# EAGLE design geiger (EAGLE 8.3.2)
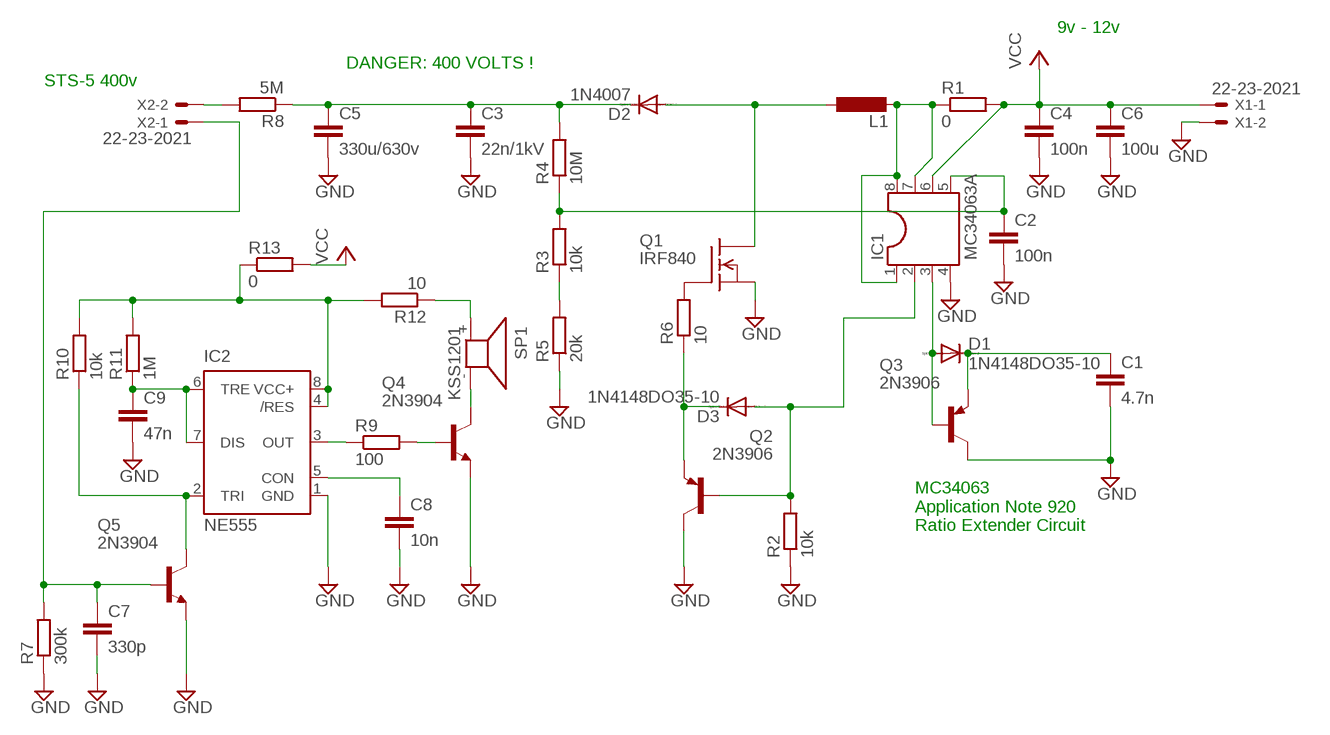
[diagram p0: schematic, sheet 1]

## Parts
C1  4.7n  C-EU025-025X050  [C025-025X050]
C2  100n  C-EU025-025X050  [C025-025X050]
C3  22n/1kV  C-EU050-050X075  [C050-050X075]
C4  100n  C-EU025-025X050  [C025-025X050]
C5  330u/630v  C-EU050-050X075  [C050-050X075]
C6  100u  C-EU025-025X050  [C025-025X050]
C7  330p  C-EU025-025X050  [C025-025X050]
C8  10n  C-EU025-025X050  [C025-025X050]
C9  47n  C-EU025-025X050  [C025-025X050]
D1  1N4148DO35-10  [DO35-10]
D2  1N4007  DIODE-D-7.5  [D-7.5]
D3  1N4148DO35-10  [DO35-10]
IC1  MC34063A  DIL8  [DIL08]
IC2  NE555  [DIL-08]
L1  L-EU0207/12  [0207/12]
Q1  IRF840  [TO220]
Q2  2N3906  [TO92]
Q3  2N3906  [TO92]
Q4  2N3904  [TO92]
Q5  2N3904  [TO92]
R1  0  R-EU_0204/7  [0204/7]
R2  10k  R-EU_0204/7  [0204/7]
R3  10k  R-EU_0204/7  [0204/7]
R4  10M  R-EU_0204/7  [0204/7]
R5  20k  R-EU_0204/7  [0204/7]
R6  10  R-EU_0204/7  [0204/7]
R7  300k  R-EU_0204/7  [0204/7]
R8  5M  R-EU_0204/7  [0204/7]
R9  100  R-EU_0204/7  [0204/7]
R10  10k  R-EU_0204/7  [0204/7]
R11  1M  R-EU_0204/7  [0204/7]
R12  10  R-EU_0204/7  [0204/7]
R13  0  R-EU_0204/7  [0204/7]
SP1  KSS1201  [KSS1201]
X1  22-23-2021  [22-23-2021]
X2  22-23-2021  [22-23-2021]

## Nets
GND: C1.2 C2.2 C3.2 C4.2 C5.2 C6.2 C7.2 C8.2 C9.2 IC1.4 IC2.1(GND) Q1.3(S) Q2.1(C) Q3.1(C) Q4.3(E) Q5.3(E) R2.1 R5.1 R7.1 X1.2
N$1: D1.A IC1.3 Q3.2(B)
N$2: C1.1 D1.C Q3.3(E)
N$3: D2.A L1.1 Q1.2(D)
N$4: R3.1 R5.2
N$5: IC1.1 IC1.7 IC1.8 L1.2 R1.1
N$6: D3.C Q2.3(E) R6.1
N$7: IC2.4(/RES) IC2.8(VCC+) R10.2 R11.2 R12.2 R13.1
N$8: C3.1 C5.1 D2.C R4.2 R8.1
N$9: Q1.1(G) R6.2
N$10: C7.1 Q5.2(B) R7.2 X2.1
N$11: D3.A IC1.2 Q2.2(B) R2.2
N$12: R8.2 X2.2
N$13: IC2.2(TRI) Q5.1(C) R10.1
N$14: C8.1 IC2.5(CON)
N$15: IC2.3(OUT) R9.1
N$16: Q4.2(B) R9.2
N$17: Q4.1(C) SP1.-
N$18: C9.1 IC2.6(TRE) IC2.7(DIS) R11.1
N$19: R12.1 SP1.+
N$20: C2.1 IC1.5 R3.2 R4.1
VCC: C4.1 C6.1 IC1.6 R1.2 R13.2 X1.1

## Notes on the sheet
- 9v - 12v
- DANGER: 400 VOLTS !
- STS-5 400v
- MC34063
  Application Note 920
  Ratio Extender Circuit

## Library data of the parts
C1-C9 = rcl:C-EU: CAPACITOR, European symbol
D1 D3 = diode:1N4148: DIODE high speed (Philips)
D2 = diode:DIODE-: DIODE
IC1 = ic-package:DIL8: Dual In Line / Socket
IC2 = st-microelectronics:NE555: General purpose bipolar Timer; MF: Arrow Electronics; MPN: NE555N; OC_FARNELL: 1467742; OC_NEWARK: 89K1486
L1 = rcl:L-EU: INDUCTOR, European symbol
Q1 = transistor-fet:IRF840: N-Channel Enhancement MOSFET (HEXFET); 500V; 8A; 0,85Ohm
Q2 Q3 = transistor-pnp:2N3906: PNP Transistor
Q4 Q5 = transistor-npn:2N3904: NPN Transistor
R1-R13 = rcl:R-EU_: RESISTOR, European symbol
SP1 = buzzer:KSS1201: SPEAKER Source: Schukat; OC_FARNELL: unknown; OC_NEWARK: unknown
X1 X2 = con-molex:22-23-2021: .100" (2.54mm) Center Header - 2 Pin; MF: MOLEX; MPN: 22-23-2021; OC_FARNELL: 1462926; OC_NEWARK: 25C3832

## Board
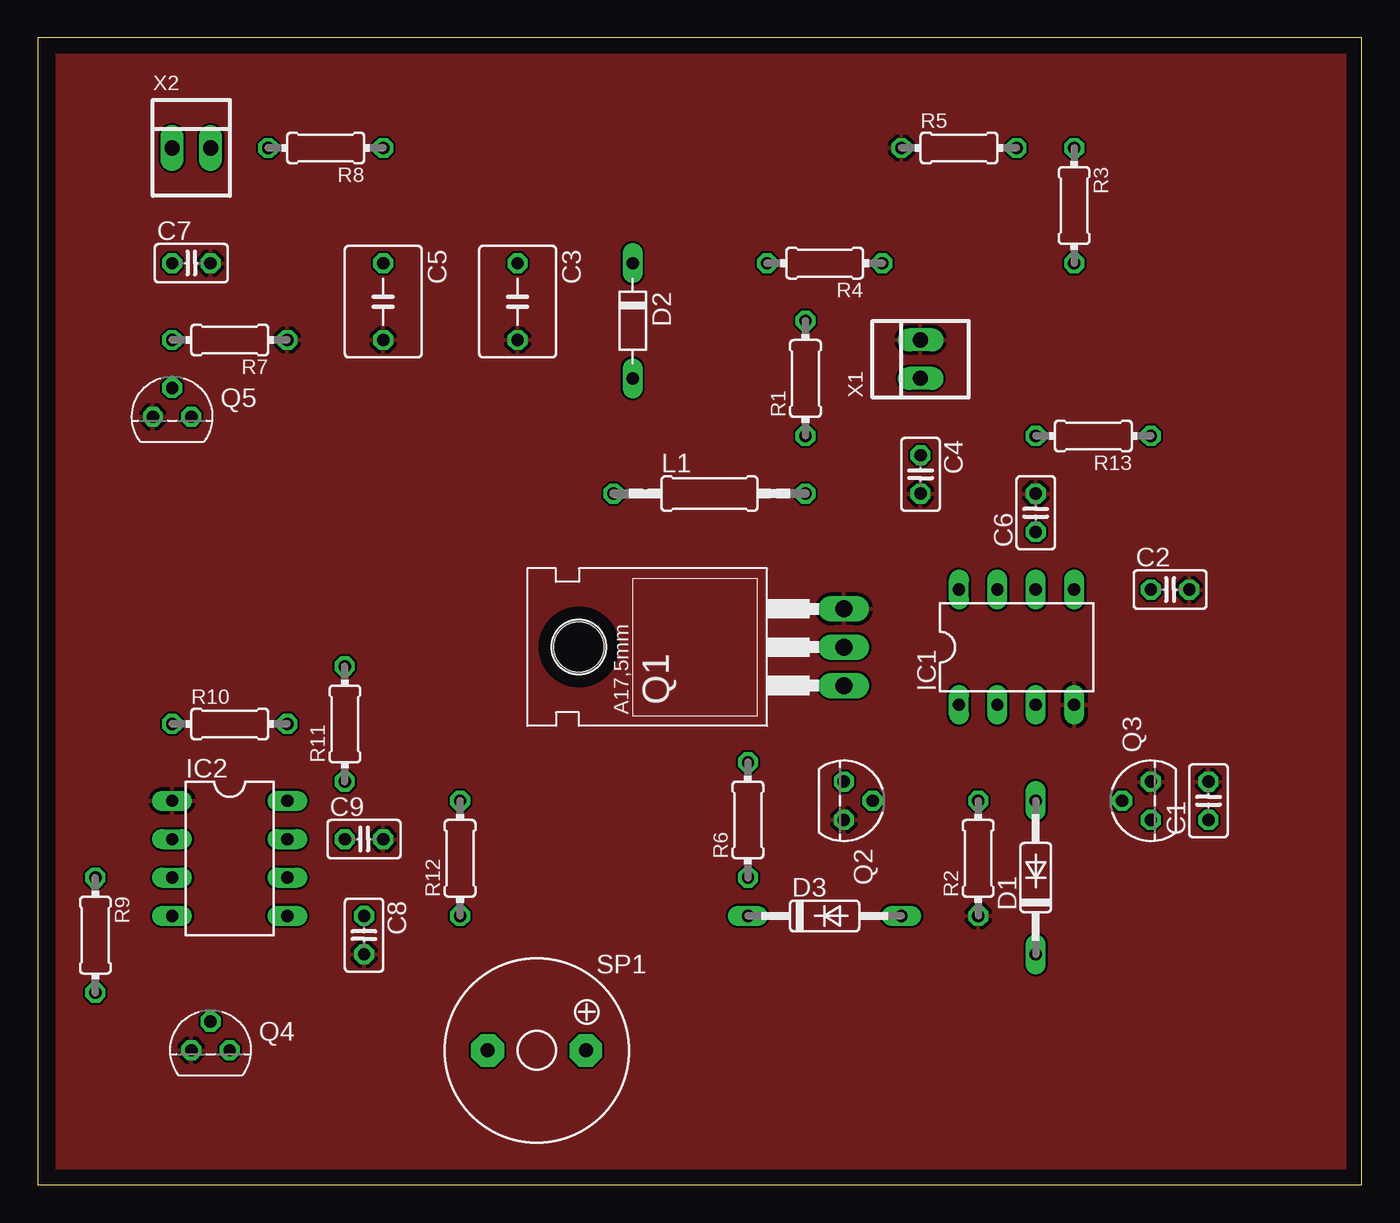
[diagram p1: board, top side]
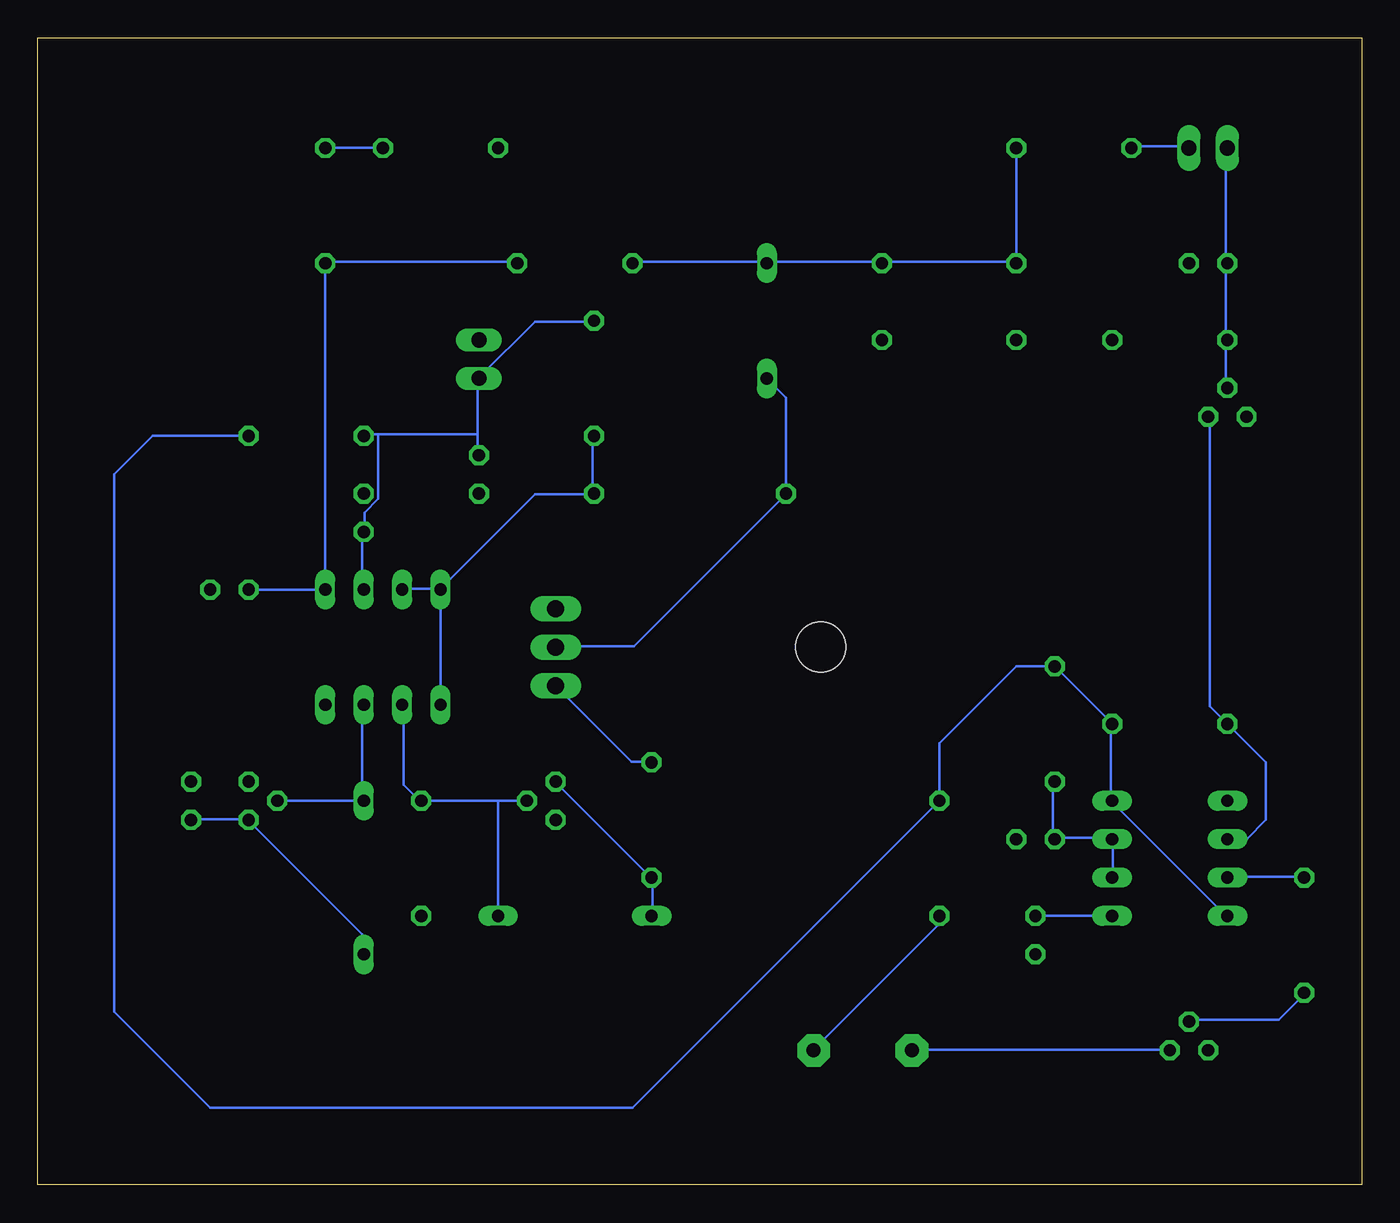
[diagram p2: board, bottom side, seen from below]

Size 87.61 x 75.87 mm. Coordinates in mm from the lower left corner, seen from the top.
Outline: 0,0 87.61,0 87.61,75.87 0,75.87 0,0
Copper layers (1*16): Top 0.035mm / dielectric 1.5mm / Bottom 0.035mm
Design rules "default": minimum track width 6mil, minimum drill 0.35mm, track to track 6mil, track to pad 6mil, pad to pad 6mil, via to via 6mil, smd to smd 6mil, copper to edge 40mil, drill to drill 6mil, minimum pad ring 10mil, minimum via ring 8mil, stop-mask expansion 4mil, vias tented up to drill 0mil, thermal gap 10mil

### Footprints (pad centres in the part's own frame; a part is rotated, then mirrored left to right if it is on the bottom)
C025-025X050 = drill 0.813 octagon: 1 -1.27,0; 2 1.27,0
C050-050X075 = drill 0.813 octagon: 1 -2.54,0; 2 2.54,0
DO35-10 = drill 0.813 long: A 5.08,0; C -5.08,0
D-7.5 = drill 0.813 long: A 3.81,0; C -3.81,0
DIL08 = drill 0.813 long: 1 -3.81,-3.81; 2 -1.27,-3.81; 3 1.27,-3.81; 4 3.81,-3.81; 5 3.81,3.81; 6 1.27,3.81; 7 -1.27,3.81; 8 -3.81,3.81
DIL-08 = drill 0.813 long: 1 -3.81,-3.81; 2 -1.27,-3.81; 3 1.27,-3.81; 4 3.81,-3.81; 5 3.81,3.81; 6 1.27,3.81; 7 -1.27,3.81; 8 -3.81,3.81
0207/12 = drill 0.813 octagon: 1 -6.35,0; 2 6.35,0
TO220 = drill 1.118 long: 1 -2.54,-6.35; 2 0,-6.35; 3 2.54,-6.35 | hole 3.302: 0,11.176
TO92 = drill 0.813 octagon: 1 1.27,0; 2 0,1.905; 3 -1.27,0
0204/7 = drill 0.813 octagon: 1 -3.81,0; 2 3.81,0
KSS1201 = drill 0.914 pad 2.159 octagon: + 3.251,0; - -3.251,0
22-23-2021 = drill 1 long: 1 -1.27,0; 2 1.27,0

### Placement (x,y rotation side)
C1  77.47,25.4 90 top
C2  74.93,39.37 0 top
C3  31.75,58.42 270 top
C4  58.42,46.99 270 top
C5  22.86,58.42 270 top
C6  66.04,44.45 90 top
C7  10.16,60.96 0 top
C8  21.59,16.51 270 top
C9  21.59,22.86 0 top
D1  66.04,20.32 90 top
D2  39.37,57.15 270 top
D3  52.07,17.78 0 top
IC1  64.77,35.56 0 top
IC2  12.7,21.59 270 top
L1  44.45,45.72 0 top
Q1  46.99,35.56 90 top
Q2  53.34,25.4 270 top
Q3  73.66,25.4 90 top
Q4  11.43,8.89 0 top
Q5  8.89,50.8 0 top
R1  50.8,53.34 90 top
R2  62.23,21.59 90 top
R3  68.58,64.77 270 top
R4  52.07,60.96 180 top
R5  60.96,68.58 0 top
R6  46.99,24.13 90 top
R7  12.7,55.88 180 top
R8  19.05,68.58 180 top
R9  3.81,16.51 270 top
R10  12.7,30.48 0 top
R11  20.32,30.48 90 top
R12  27.94,21.59 90 top
R13  69.85,49.53 180 top
SP1  33.02,8.89 0 top
X1  58.42,54.61 90 top
X2  10.16,68.58 0 top

### Tracks (layer width: path | path; a pad name or v marks a point on that pad's centre or on a via)
GND
  pour Top: 107.95,74.93 107.95,-6.35 1.27,-6.35 1.27,74.93
N$1
  Bottom 0.152: Q3.2 66.14,25.4 | 66.14,25.4 66.14,31.65 IC1.3 | 66.14,25.4 D1.A
N$2
  Bottom 0.152: D1.C 66.14,15.34 66.14,16.56 73.61,24.03 Q3.3 73.76,24.18 77.42,24.18 C1.1
N$3
  Bottom 0.152: D2.A 38.1,52.07 L1.1 38.1,45.67 48.16,35.61 53.34,35.61 Q1.2
N$4
  Bottom 0.152: R5.2 R3.1
N$5
  Bottom 0.152: R1.1 50.9,49.48 50.9,45.82 L1.2 50.9,45.67 54.71,45.67 60.96,39.42 | IC1.1 IC1.8 60.96,39.42 | 60.96,39.42 63.4,39.42 IC1.7
N$6
  Bottom 0.152: D3.C 46.94,17.78 46.94,20.22 R6.1 47.09,20.37 53.34,26.62 Q2.3
N$7
  Bottom 0.152: R13.1 80.01,49.53 82.55,46.99 82.55,11.43 76.2,5.08 48.26,5.08 R12.2 27.94,29.21 22.86,34.29 R11.2 R10.2 16.61,30.43 16.61,25.4 | 16.61,25.4 8.99,17.78 IC2.4 | 16.61,25.4 IC2.8
N$8
  Bottom 0.152: R8.1 22.86,61.06 | R4.2 48.16,61.06 39.47,61.06 D2.C 39.32,61.06 31.85,61.06 C3.1 31.7,61.06 22.86,61.06 | 22.86,61.06 C5.1
N$9
  Bottom 0.152: Q1.1 48.31,27.99 47.09,27.99 R6.2
N$10
  Bottom 0.152: 8.99,55.88 8.99,52.83 Q5.2 | 8.99,55.88 8.99,60.91 C7.1 8.99,61.06 8.99,68.53 X2.1 | 8.99,55.88 R7.2
N$11
  Bottom 0.152: 57.15,25.4 R2.2 62.33,25.4 63.4,26.47 63.4,31.65 IC1.2 | 57.15,25.4 Q2.2 | 57.15,25.4 D3.A
N$12
  Bottom 0.152: R8.2 15.24,68.68 11.43,68.68 X2.2
N$13
  Bottom 0.152: Q5.1 10.06,50.7 10.06,31.65 R10.1 6.35,27.94 6.35,24.13 7.62,22.86 IC2.2
N$14
  Bottom 0.152: C8.1 IC2.5
N$15
  Bottom 0.152: R9.1 3.81,20.37 8.84,20.37 IC2.3
N$16
  Bottom 0.152: Q4.2 11.43,10.92 5.49,10.92 3.81,12.6 R9.2
N$17
  Bottom 0.152: Q4.1 12.8,8.94 29.72,8.94 SP1.-
N$18
  Bottom 0.152: IC2.6 16.46,20.37 16.46,22.81 IC2.7 16.61,22.96 20.27,22.96 C9.1 20.42,22.96 20.42,26.62 R11.1
N$19
  Bottom 0.152: R12.1 28.04,17.78 28.04,17.17 36.27,8.94 SP1.+
N$20
  Bottom 0.152: R4.1 55.93,61.06 68.58,61.06 R3.2 IC1.5 C2.1
VCC
  Bottom 0.152: IC1.6 66.14,39.42 66.14,43.08 C6.1 65.99,43.23 65.99,44.45 65.08,45.36 65.08,49.63 | 58.52,49.63 58.52,53.29 X1.1 58.37,53.44 54.71,57.1 50.9,57.1 R1.2 | 58.52,49.63 58.52,48.26 C4.1 | 58.52,49.63 65.08,49.63 | 65.08,49.63 65.99,49.63 R13.2